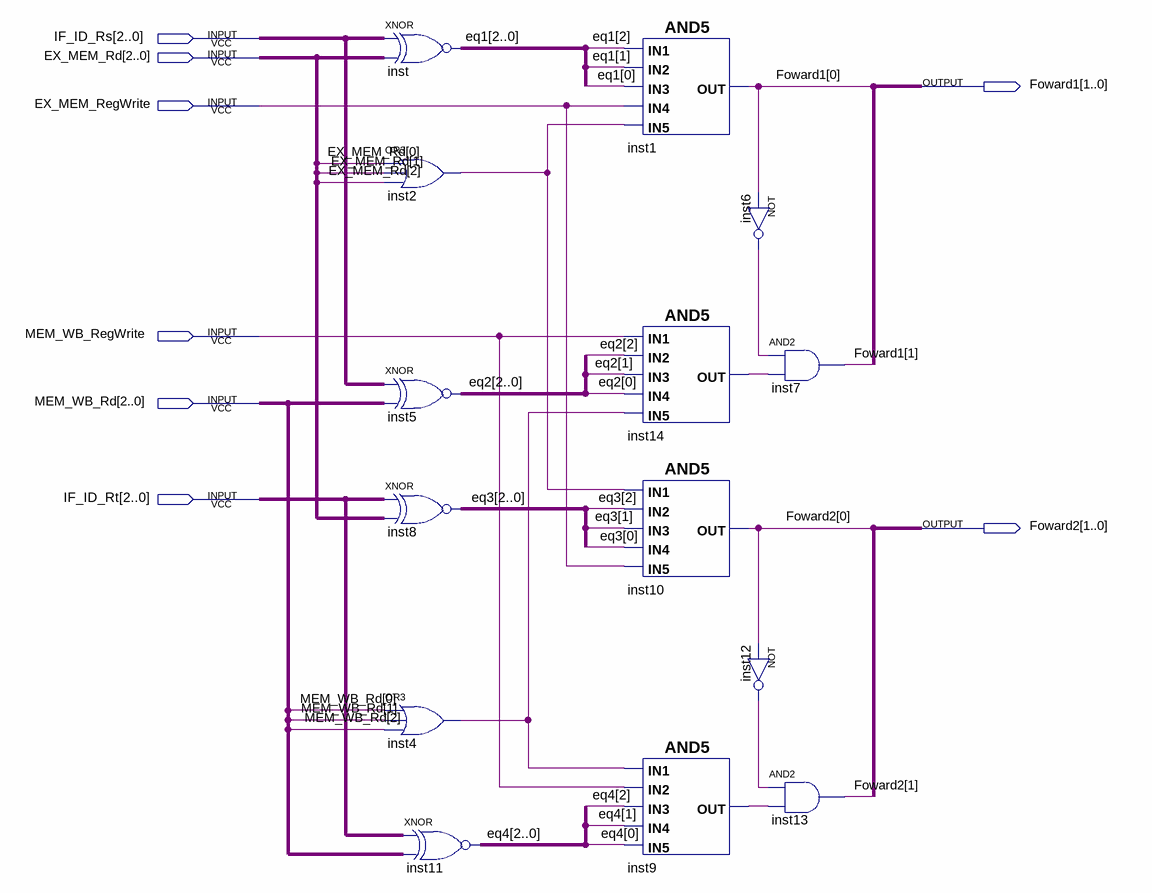
[diagram p0: schematic sheet]
// Quartus schematic MDUFowardingUnit.bdf as structural Verilog: 14 symbols, 8 pins
module MDUFowardingUnit (
  input  [2:0] IF_ID_Rs,
  input  [2:0] EX_MEM_Rd,
  input  EX_MEM_RegWrite,
  input  MEM_WB_RegWrite,
  input  [2:0] MEM_WB_Rd,
  input  [2:0] IF_ID_Rt,
  output [1:0] Foward1,
  output [1:0] Foward2
);

  wire inst2_out, inst4_out, inst6_out, inst9_out, inst12_out, inst14_out;
  wire [2:0] eq1, eq2, eq3, eq4;

  assign eq1 = ~(IF_ID_Rs ^ EX_MEM_Rd);  // XNOR inst, 3 bits wide
  or inst2 (inst2_out, EX_MEM_Rd[0], EX_MEM_Rd[1], EX_MEM_Rd[2]);
  assign eq2 = ~(IF_ID_Rs ^ MEM_WB_Rd);  // XNOR inst5, 3 bits wide
  assign eq3 = ~(IF_ID_Rt ^ EX_MEM_Rd);  // XNOR inst8, 3 bits wide
  or inst4 (inst4_out, MEM_WB_Rd[0], MEM_WB_Rd[1], MEM_WB_Rd[2]);
  assign eq4 = ~(IF_ID_Rt ^ MEM_WB_Rd);  // XNOR inst11, 3 bits wide
  and inst1 (Foward1[0], eq1[2], eq1[1], eq1[0], EX_MEM_RegWrite, inst2_out);
  and inst14 (inst14_out, MEM_WB_RegWrite, eq2[2], eq2[1], eq2[0], inst4_out);
  and inst10 (Foward2[0], inst2_out, eq3[2], eq3[1], eq3[0], EX_MEM_RegWrite);
  and inst9 (inst9_out, inst4_out, MEM_WB_RegWrite, eq4[2], eq4[1], eq4[0]);
  not inst6 (inst6_out, Foward1[0]);
  not inst12 (inst12_out, Foward2[0]);
  and inst7 (Foward1[1], inst6_out, inst14_out);
  and inst13 (Foward2[1], inst12_out, inst9_out);
endmodule
